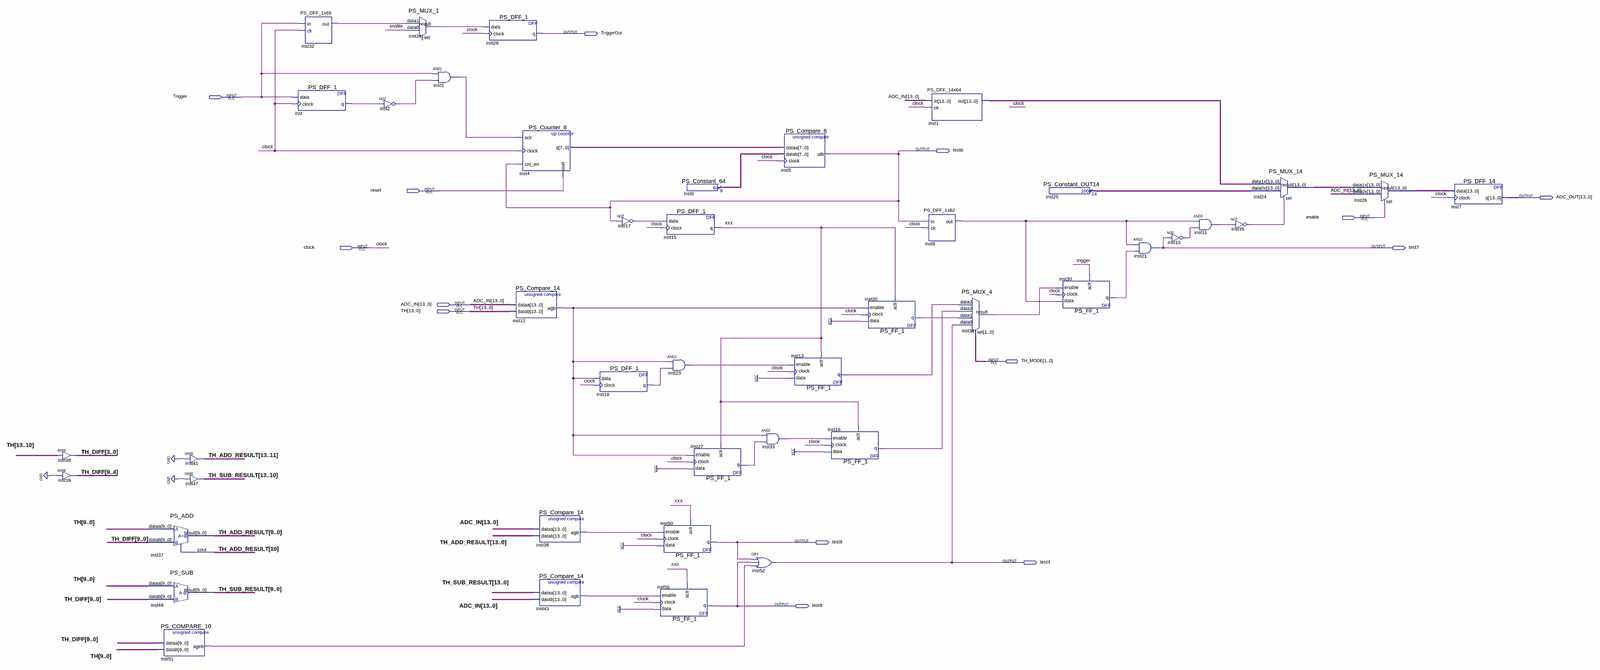
[diagram p0: schematic sheet, whole]
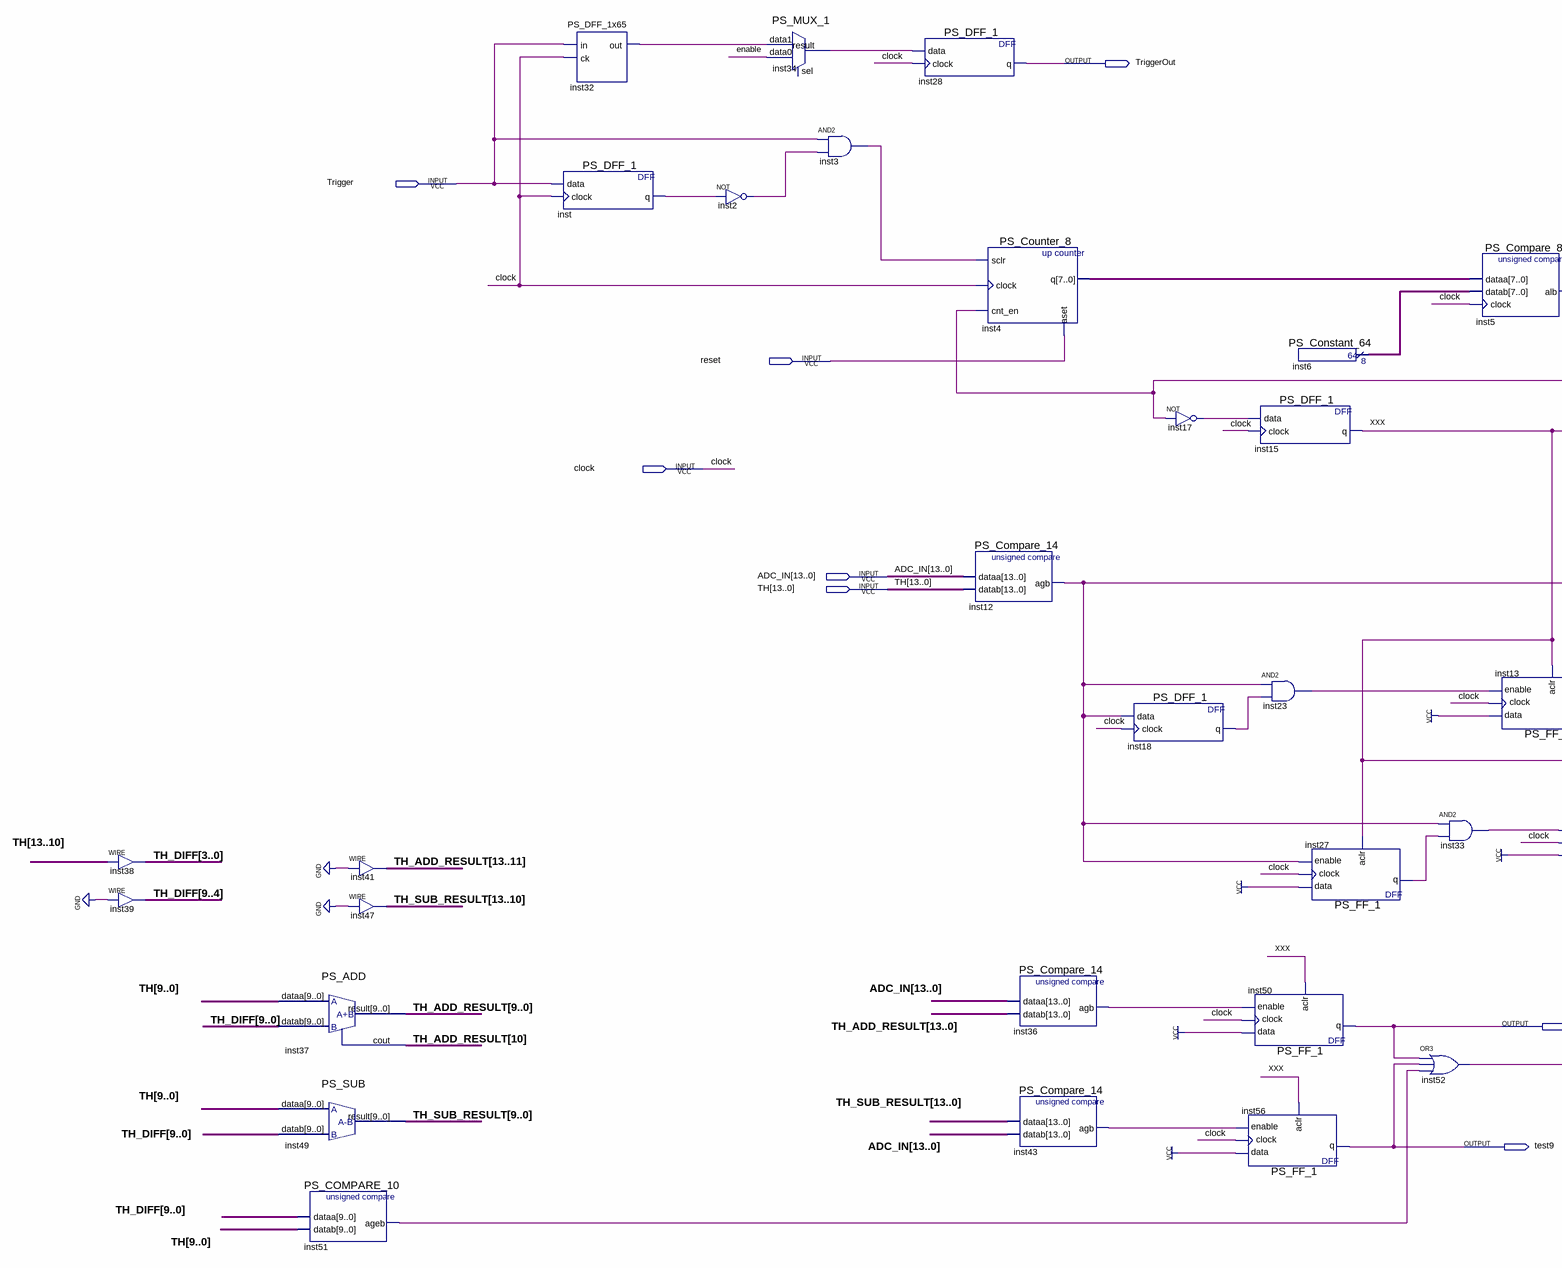
[diagram p1: schematic sheet, left part]
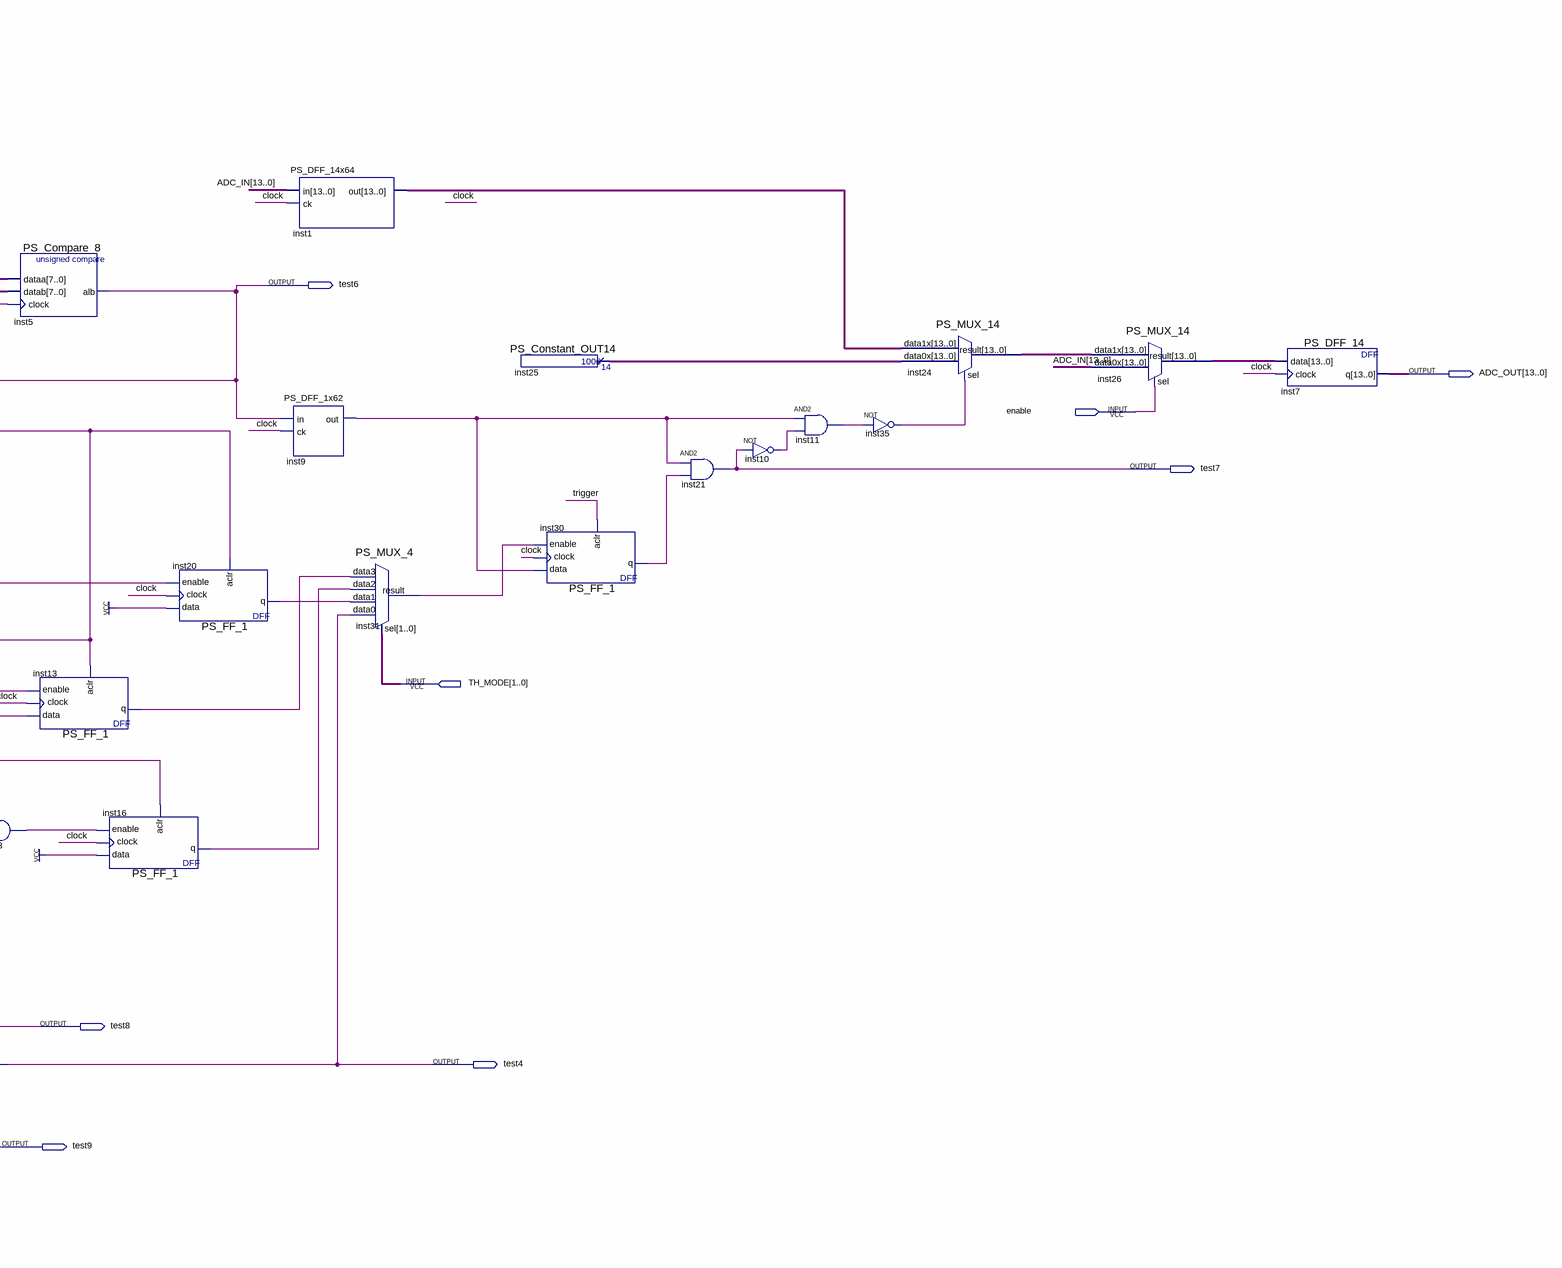
[diagram p2: schematic sheet, right part]
// Quartus schematic PS_Channel.bdf as structural Verilog: 43 symbols, 14 pins
module PS_Channel (
  input  Trigger,
  input  reset,
  input  enable,
  input  clock,
  input  [13:0] ADC_IN,
  input  [13:0] TH,
  input  [1:0] TH_MODE,
  output TriggerOut,
  output test6,
  output [13:0] ADC_OUT,
  output test7,
  output test8,
  output test4,
  output test9
);

  wire inst2_out, inst3_out, inst9_out, inst10_out, inst11_out, inst12_agb, inst13_q, inst16_q, inst17_out,
       inst18_q, inst20_q, inst23_out, inst27_q, inst30_q, inst31_result, inst32_out, inst33_out,
       inst34_result, inst35_out, inst36_agb, inst43_agb, inst51_ageb, inst_q, XXX;
  wire [7:0] inst4_q, inst6_result;
  wire [9:0] TH_DIFF;
  wire [13:0] inst1_out, inst24_result, inst25_result, inst26_result, TH_ADD_RESULT, TH_SUB_RESULT;

  assign TH_DIFF[3:0] = TH[13:10];  // WIRE inst38
  assign TH_DIFF[9:4] = {6{1'b0}};  // WIRE inst39
  PS_ADD inst37 (.dataa(TH[9:0]), .datab(TH_DIFF), .result(TH_ADD_RESULT[9:0]), .cout(TH_ADD_RESULT[10]));
  PS_SUB inst49 (.dataa(TH[9:0]), .datab(TH_DIFF), .result(TH_SUB_RESULT[9:0]));
  PS_COMPARE_10 inst51 (.dataa(TH_DIFF), .datab(TH[9:0]), .ageb(inst51_ageb));
  assign TH_ADD_RESULT[13:11] = 3'b000;  // WIRE inst41
  assign TH_SUB_RESULT[13:10] = 4'b0000;  // WIRE inst47
  PS_DFF_1x65 inst32 (.in(Trigger), .ck(clock), .out(inst32_out));
  PS_DFF_1 inst (.data(Trigger), .clock(clock), .q(inst_q));
  not inst2 (inst2_out, inst_q);
  PS_MUX_1 inst34 (.data1(inst32_out), .data0(enable), .result(inst34_result));  // open: sel
  and inst3 (inst3_out, Trigger, inst2_out);
  PS_DFF_1 inst28 (.data(inst34_result), .clock(clock), .q(TriggerOut));
  PS_Counter_8 inst4 (.sclr(inst3_out), .clock(clock), .cnt_en(test6), .aset(reset), .q(inst4_q));
  PS_Compare_14 inst12 (.dataa(ADC_IN), .datab(TH), .agb(inst12_agb));
  PS_Compare_14 inst36 (.dataa(ADC_IN), .datab(TH_ADD_RESULT), .agb(inst36_agb));
  PS_Compare_14 inst43 (.dataa(TH_SUB_RESULT), .datab(ADC_IN), .agb(inst43_agb));
  PS_DFF_1 inst18 (.data(inst12_agb), .clock(clock), .q(inst18_q));
  not inst17 (inst17_out, test6);
  PS_DFF_1 inst15 (.data(inst17_out), .clock(clock), .q(XXX));
  PS_FF_1 inst50 (.data(1'b1), .clock(clock), .enable(inst36_agb), .aclr(XXX), .q(test8));
  PS_FF_1 inst56 (.data(1'b1), .clock(clock), .enable(inst43_agb), .aclr(XXX), .q(test9));
  PS_Constant_64 inst6 (.result(inst6_result));
  and inst23 (inst23_out, inst12_agb, inst18_q);
  PS_FF_1 inst27 (.data(1'b1), .clock(clock), .enable(inst12_agb), .aclr(XXX), .q(inst27_q));
  and inst33 (inst33_out, inst12_agb, inst27_q);
  or inst52 (test4, test8, test9, inst51_ageb);
  PS_Compare_8 inst5 (.dataa(inst4_q), .datab(inst6_result), .clock(clock), .alb(test6));
  PS_FF_1 inst13 (.data(1'b1), .clock(clock), .enable(inst23_out), .aclr(XXX), .q(inst13_q));
  PS_FF_1 inst16 (.data(1'b1), .clock(clock), .enable(inst33_out), .aclr(XXX), .q(inst16_q));
  PS_FF_1 inst20 (.data(1'b1), .clock(clock), .enable(inst12_agb), .aclr(XXX), .q(inst20_q));
  PS_DFF_14x64 inst1 (.in(ADC_IN), .ck(clock), .out(inst1_out));
  PS_DFF_1x62 inst9 (.in(test6), .ck(clock), .out(inst9_out));
  PS_MUX_4 inst31 (
    .data3(inst13_q), .data2(inst16_q), .data1(inst20_q), .data0(test4), .sel(TH_MODE), .result(inst31_result));
  PS_Constant_OUT14 inst25 (.result(inst25_result));
  PS_FF_1 inst30 (.data(inst9_out), .clock(clock), .enable(inst31_result), .aclr(Trigger), .q(inst30_q));
  and inst21 (test7, inst9_out, inst30_q);
  not inst10 (inst10_out, test7);
  and inst11 (inst11_out, inst9_out, inst10_out);
  PS_MUX_14 inst24 (.data1x(inst1_out), .data0x(inst25_result), .sel(inst35_out), .result(inst24_result));
  not inst35 (inst35_out, inst11_out);
  PS_MUX_14 inst26 (.data1x(inst24_result), .data0x(ADC_IN), .sel(enable), .result(inst26_result));
  PS_DFF_14 inst7 (.data(inst26_result), .clock(clock), .q(ADC_OUT));
endmodule
